# Altium schematic sheet Page A_Power.SchDoc
size 386 x 246 mm; SheetNumber: 0; SheetTotal: 0
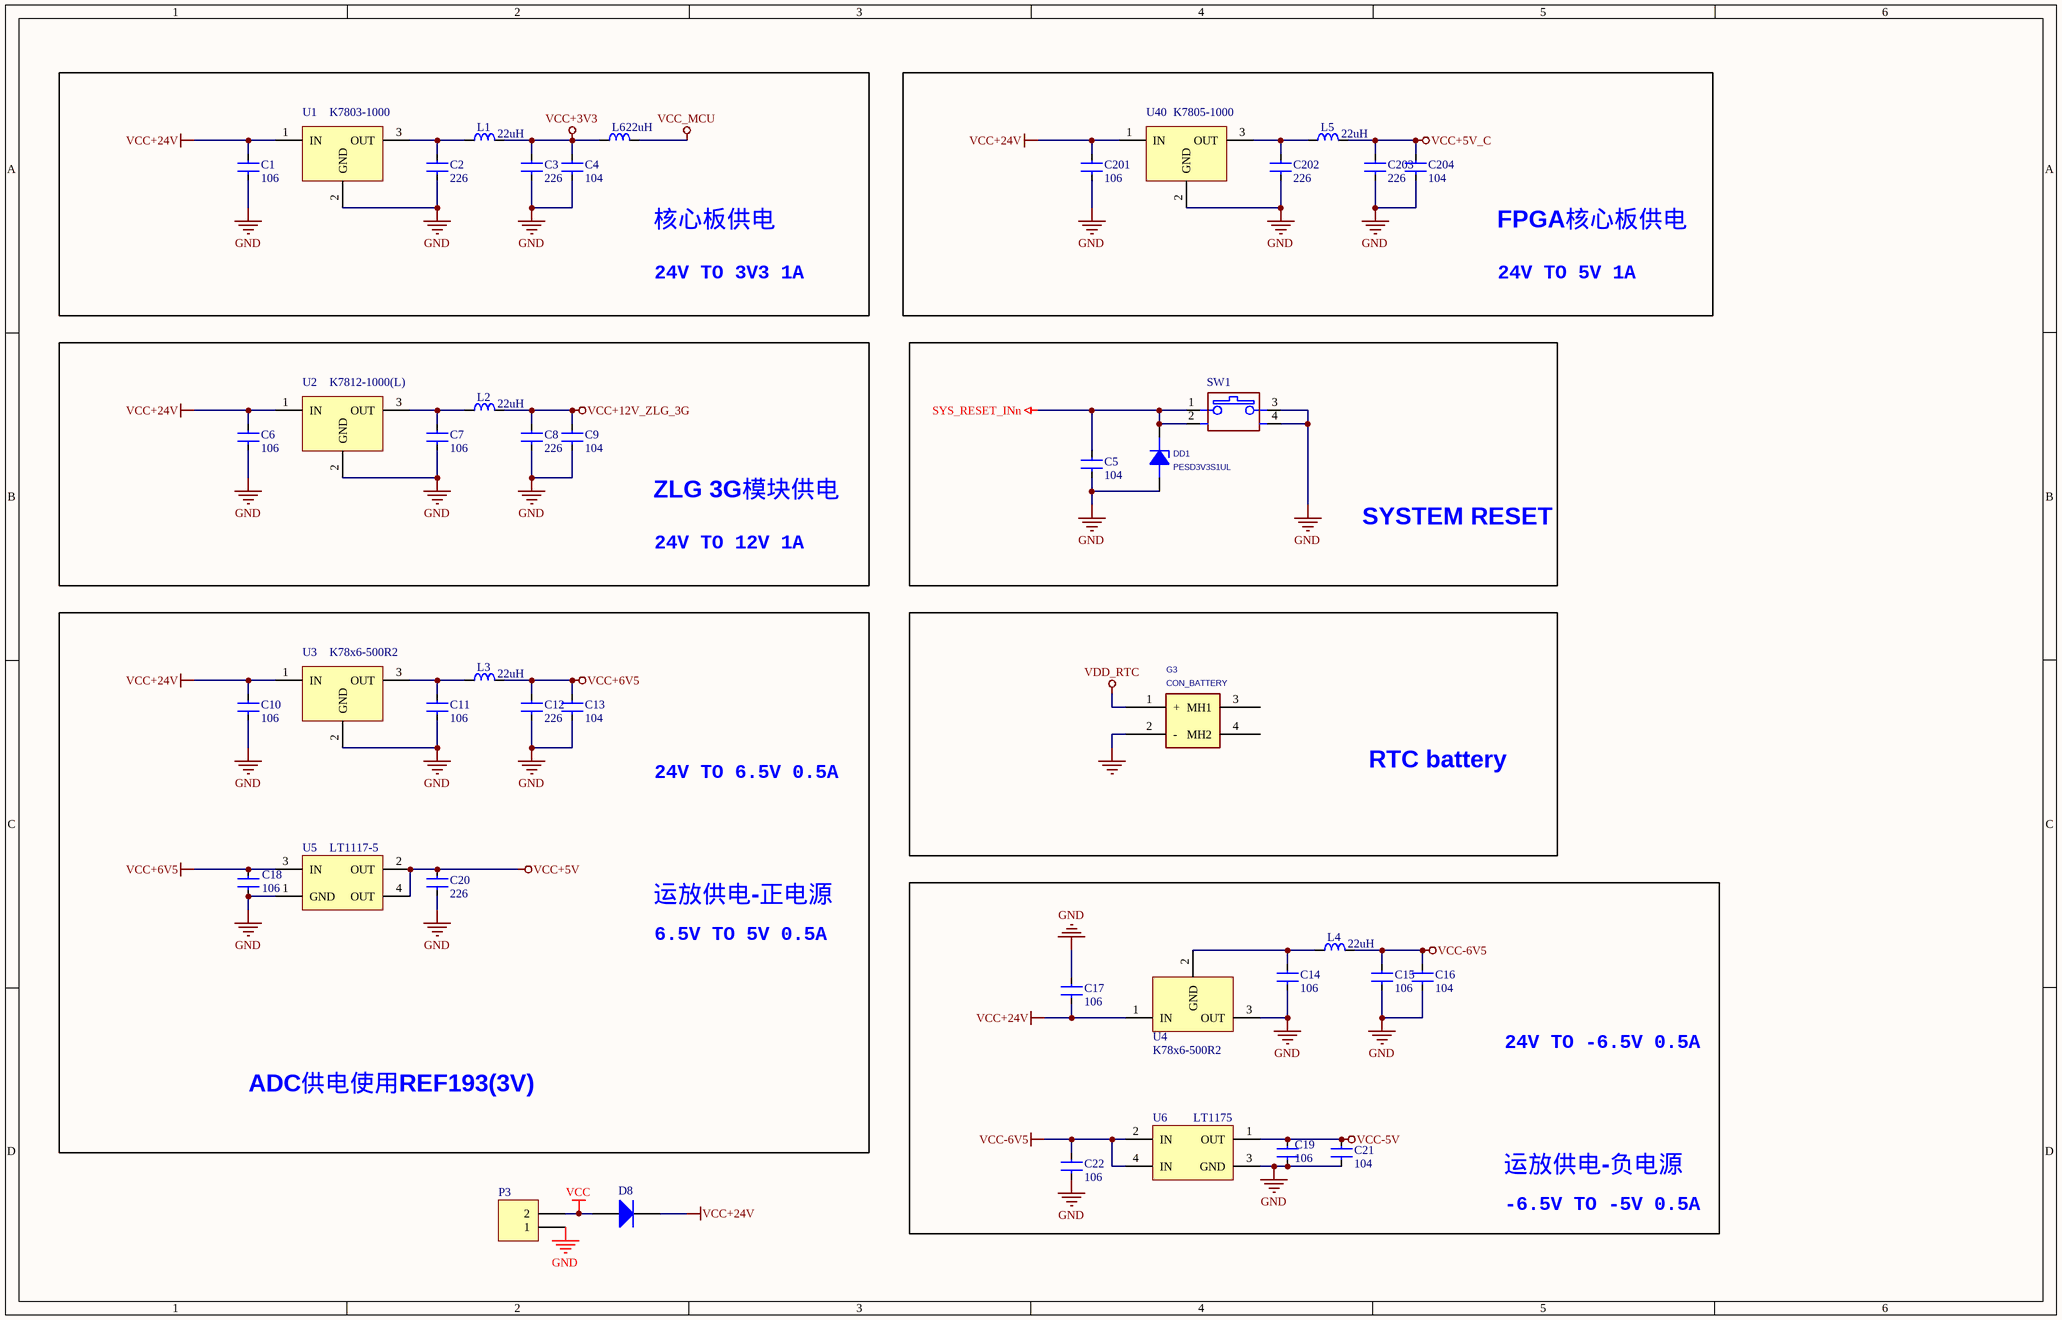
[diagram p0: Page A_Power.SchDoc]

## Parts
C1  106  [0805C]
C2  226  [0805C]
C3  226  [0805C]
C4  104  [0805C]
C5  104  [0805C]
C6  106  [0805C]
C7  106  [0805C]
C8  226  [0805C]
C9  104  [0805C]
C10  106  [0805C]
C11  106  [0805C]
C12  226  [0805C]
C13  104  [0805C]
C14  106  [0805C]
C15  106  [0805C]
C16  104  [0805C]
C17  106  [0805C]
C18  106  [0805C]
C19  106  [0805C]
C20  226  [0805C]
C21  104  [0805C]
C22  106  [0805C]
C201  106  [0805C]
C202  226  [0805C]
C203  226  [0805C]
C204  104  [0805C]
D8  1N4007  [DO-41]  (value not drawn)
DD1  PESD3V3S1UL  [SOD882]
G3  CON_BATTERY  [CON_BATTERY_CR1220]
L1  22uH  [1210]
L2  22uH  [1210]
L3  22uH  [1210]
L4  22uH  [1210]
L5  22uH  [1210]
L6  22uH  [1210]
P3  Header 2  [7.62-2P]  (value not drawn)
SW1  SW PUSHBUTTON-SPST SHIELD_0  [BUTTON_SW_SMD_4P_BIG]  (value not drawn)
U1  K7803-1000  [K78xx-500R2]
U2  K7812-1000(L)  [K78xx-L]
U3  K78x6-500R2  [K78xx-500R2]
U4  K78x6-500R2  [K78xx-500R2]
U5  LT1117-5  [SOT-223]
U6  LT1175  [SOT-223]
U40  K7805-1000  [K78xx-500R2]

## Blocks framed on the sheet
核心板供电: C1-C4 L1 L6 U1
FPGA核心板供电: C201-C204 L5 U40
ZLG 3G模块供电: C6-C9 L2 U2
SYSTEM RESET: C5 DD1 SW1
RTC battery: G3
运放供电-负电源: C14-C17 C19 C21 C22 L4 U4 U6

## Nets
GND: C1.2 C2.2 C3.2 C4.2 C5.2 C6.2 C7.2 C8.2 C9.2 C10.2 C11.2 C12.2 C13.2 C14.2 C15.2 C16.2 C17.2 C18.2 C19.2 C20.2 C21.2 C22.2 C201.2 C202.2 C203.2 C204.2 DD1.2(ANODE) G3.2(-) P3.1 SW1.3 SW1.4 U1.2(GND) U2.2(GND) U3.2(GND) U4.3(OUT) U5.1(GND) U6.3(GND) U40.2(GND)
SYS_RESET_INn: C5.1 DD1.1(CATHODE) SW1.1 SW1.2
VCC: D8.1(A) P3.2
VCC+3V3: C3.1 C4.1 L1.2 L6.1
VCC+5V: C20.1 U5.2(OUT) U5.4(OUT)
VCC+5V_C: C203.1 C204.1 L5.2
VCC+6V5: C12.1 C13.1 C18.1 L3.2 U5.3(IN)
VCC+12V_ZLG_3G: C8.1 C9.1 L2.2
VCC+24V: C1.1 C6.1 C10.1 C17.1 C201.1 D8.2(K) U1.1(IN) U2.1(IN) U3.1(IN) U4.1(IN) U40.1(IN)
VCC-5V: C19.1 C21.1 U6.1(OUT)
VCC-6V5: C15.1 C16.1 C22.1 L4.2 U6.2(IN) U6.4(IN)
VCC_MCU: L6.2
VDD_RTC: G3.1(+)
NetC2_1: C2.1 L1.1 U1.3(OUT)
NetC7_1: C7.1 L2.1 U2.3(OUT)
NetC11_1: C11.1 L3.1 U3.3(OUT)
NetC14_1: C14.1 L4.1 U4.2(GND)
NetC202_1: C202.1 L5.1 U40.3(OUT)

Not connected (* = marked no-connect by the designer): G3 3(MH1) 4(MH2)

## Notes on the sheet
- 24V TO 3V3 1A
- 24V TO 5V 1A
- 24V TO 12V 1A
- 24V TO 6.5V 0.5A
- 运放供电-正电源
- 6.5V TO 5V 0.5A
- 24V TO -6.5V 0.5A
- ADC供电使用REF193(3V)
- -6.5V TO -5V 0.5A

## Library data of the parts
C1-C18 C20 C201-C204 = C-SMD: SMD
C19 C21 C22 = C-X5R/X7R
D8 = Diode 1N4148: High Conductance Fast Diode; Published: 8-Jun-2000; LatestRevisionDate: 17-Jul-2002; LatestRevisionNote: Re-released for DXP Platform.; DatasheetDocument: 1997; PackageReference: DO-35; Publisher: Altium Limited; Code_JEDEC: DO-204-AH; ComponentLink1Description: Manufacturer Link; ComponentLink1URL: http://www.fairchildsemi.com/; ComponentLink2Description: Datasheet; ComponentLink2URL: http://www.fairchildsemi.com/ds/1N%2F1N4148.pdf
DD1 = DIODE BREAKDOWN: Manufacturer: NXP; Remark: ESD; Manufacturer PartNumber: PESD3V3S1UL
G3 = CON_BATTERY: Remark: CR1220纽扣电池座
L1-L6 = Inductor: Part Number: IND0603_TDK_MPZ1608R391A; Part Description: SMT Chip Bead for Power Line; Manufacturer: TDK; Manufacturer Part Number: MPZ1608R391A; Value: 390R@100MHz; Power: 1.2A; Resistance: 0.12R; Tolerance: ?5%; Table: Inductors SMD; Component Kind: Standard; Component Type: Standard; Footprint: INDC1608X95N; Pin Count: 2; Status: None; Case: 0603; Mounted: Yes; Socket: No; SMD: Yes; ComponentHeight: 0.95mm; HelpURL: \\cern.ch\dfs\Applications\Altium\Datasheets\IND0603_TDK_MPZ1608.pdf; Author: CERN DEM JLC; CreateDate: 02.12.2009; LatestRevisionDate: 02.12.2009
P3 = Header 2: Header, 2-Pin; LatestRevisionDate: 17-Jul-2002; LatestRevisionNote: Re-released for DXP Platform.; Publisher: Altium Limited
U1-U4 U40 = K78xx-500R2
U5 = AMS1117
SW1 = SW PUSHBUTTON-SPST SHIELD_0: Filename: *